# EAGLE design interface_spellman_detector (EAGLE 7.2.0)
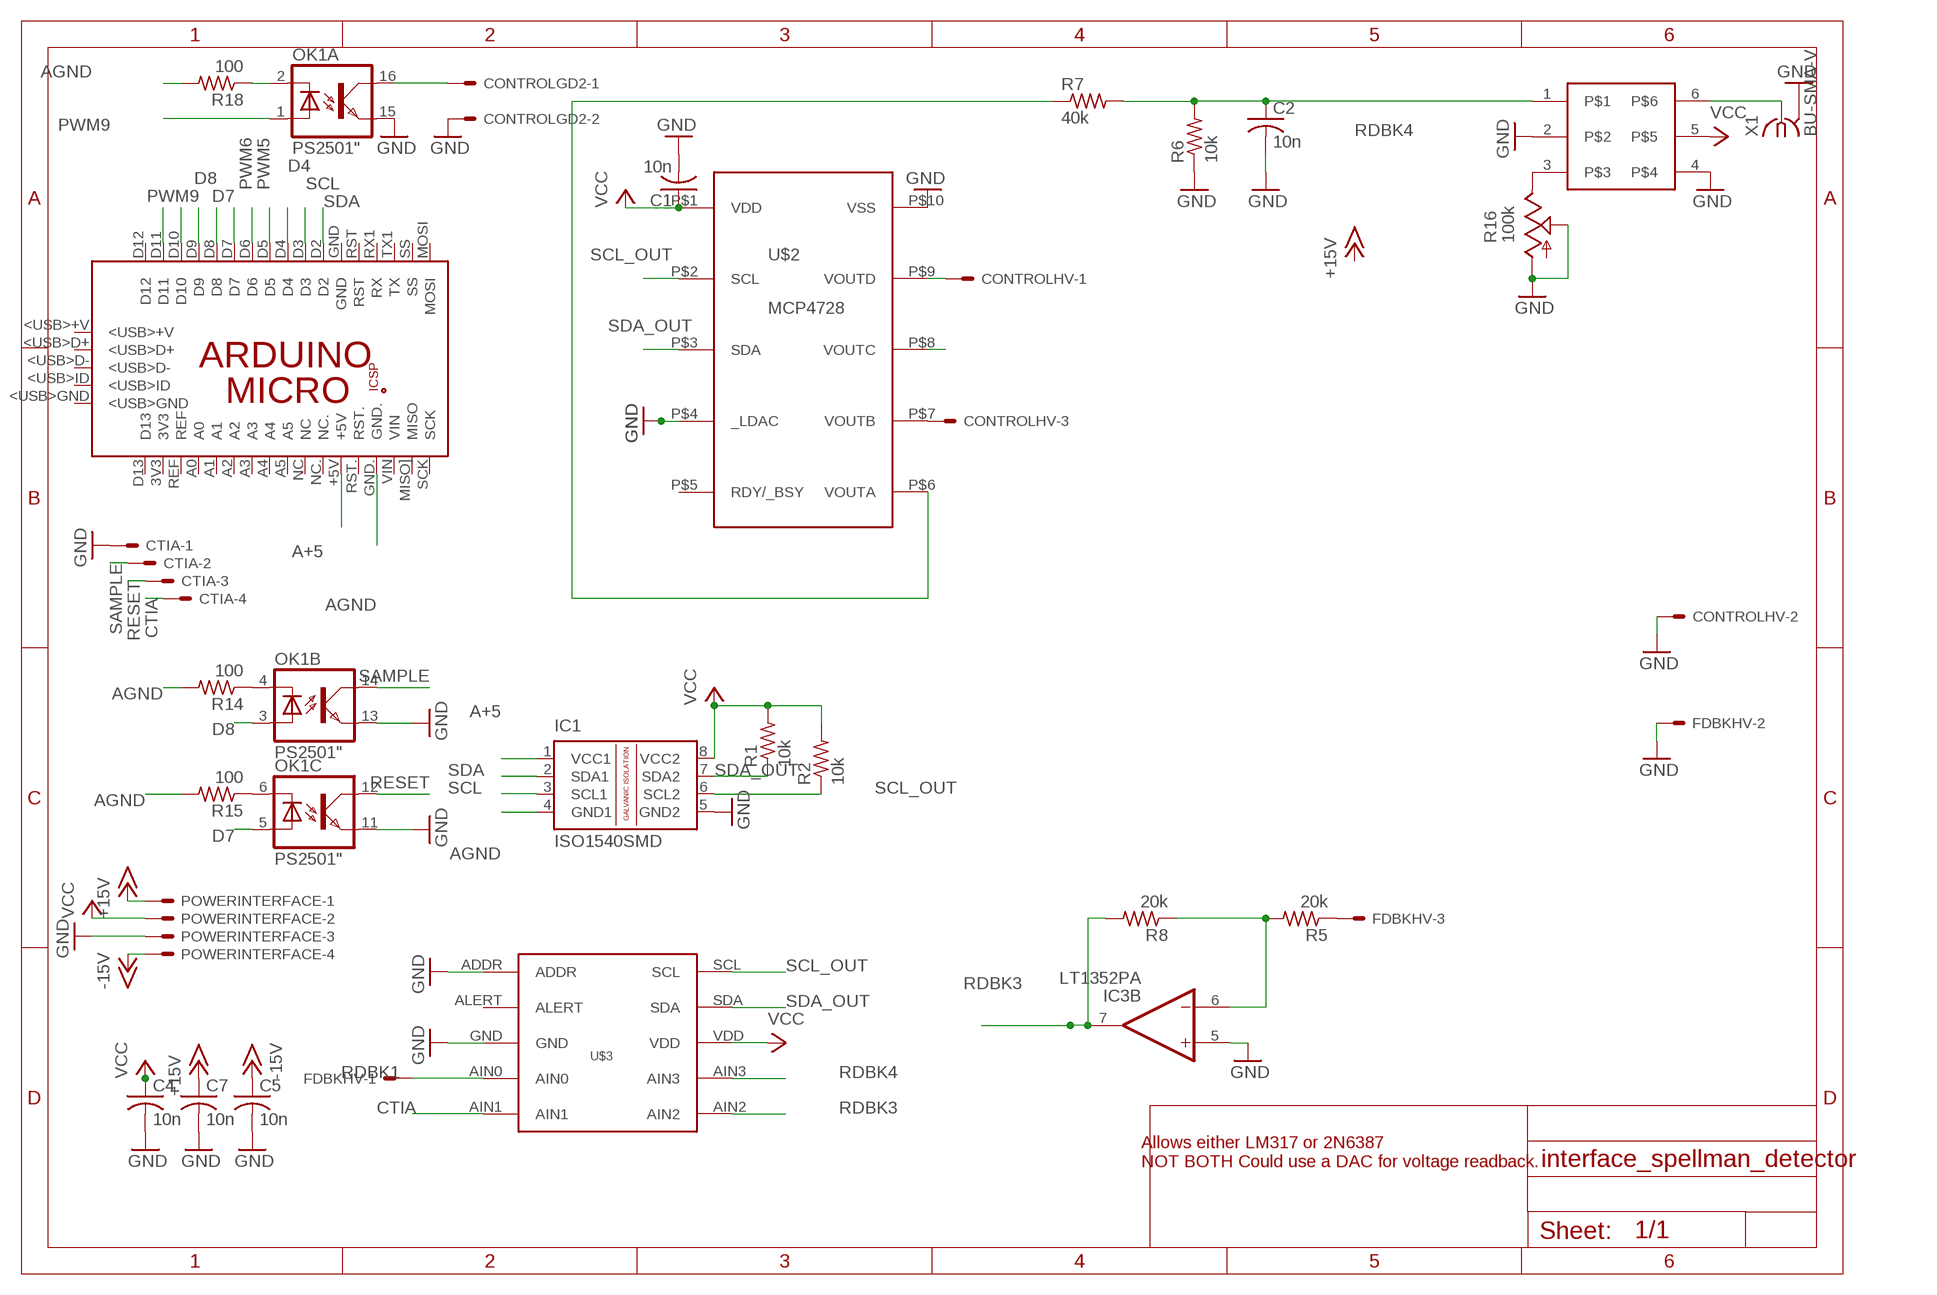
[diagram p0: schematic, sheet 1]

## Parts
C1  10n  C-USC0805K  [C0805K]
C2  10n  C-USC0805K  [C0805K]
C4  10n  C-USC0805K  [C0805K]
C5  10n  C-USC0805K  [C0805K]
C7  10n  C-USC0805K  [C0805K]
CONTROLGD2  KK-156-2  [KK-156-2]
CONTROLHV  KK-156-3  [KK-156-3]
CTIA  KK-156-4  [KK-156-4]
FDBKHV  KK-156-3  [KK-156-3]
IC1  ISO1540SMD  [SOIC8]
IC3  LT1352PA  [DIL08]
OK1  PS2501"  [DIL16]
PCB1  ARDUINO_MICRO  [ARDUINO_MICRO]
POWERINTERFACE  KK-156-4  [KK-156-4]
R1  10k  R-US_R0805  [R0805]
R2  10k  R-US_R0805  [R0805]
R5  20k  R-US_R0805  [R0805]
R6  10k  R-US_R0805  [R0805]
R7  40k  R-US_R0805  [R0805]
R8  20k  R-US_R0805  [R0805]
R14  100  R-US_R0805  [R0805]
R15  100  R-US_R0805  [R0805]
R16  100k  TRIM_US-B64Y  [B64Y]
R18  100  R-US_R0805  [R0805]
U$1  LTC6992SMD  [SOT23-6]
U$2  MCP4728  [MSOP-10]
U$3  ADS1015  [VSOP-10]
X1  BU-SMA-V  [BU-SMA-V]

## Nets
+15V: C7.1 POWERINTERFACE.1
-15V: C5.1 POWERINTERFACE.4
A+5: IC1.1(VCC1) PCB1.+5V
AGND: IC1.4(GND1) PCB1.GND. R14.2 R15.2 R18.2
CTIA: CTIA.4 U$3.AIN1
D4: PCB1.D4
D7: OK1.5(C:A) PCB1.D7
D8: OK1.3(B:A) PCB1.D8
D10: PCB1.D10
D11: PCB1.D11
ENSW2: CONTROLGD2.1 OK1.16(A:COL)
GND: C1.2 C2.2 C4.2 C5.2 C7.2 CONTROLGD2.2 CONTROLHV.2 CTIA.1 FDBKHV.2 IC1.5(GND2) IC3.5(B:+IN) OK1.11(C:EMI) OK1.13(B:EMI) OK1.15(A:EMI) POWERINTERFACE.3 R6.1 R16.A R16.S U$1.2 U$1.4 U$2.P$4(_LDAC) U$2.P$10(VSS) U$3.ADDR U$3.GND X1.2 X1.3 X1.4 X1.5
N$1: R7.1 U$2.P$6(VOUTA)
N$2: OK1.4(B:C) R14.1
N$3: CONTROLHV.3 U$2.P$7(VOUTB)
N$6: OK1.6(C:C) R15.1
N$7: OK1.2(A:C) R18.1
N$8: FDBKHV.3 R5.1
N$12: R16.E U$1.3
N$13: U$1.6 X1.1
N$23: IC3.6(B:-IN) R5.2 R8.1
N$24: CONTROLHV.1 U$2.P$9(VOUTD)
N$26: U$2.P$8(VOUTC)
PWM5: PCB1.D5
PWM6: PCB1.D6
PWM9: OK1.1(A:A) PCB1.D9
RDBK1: FDBKHV.1 U$3.AIN0
RDBK3: IC3.7(B:OUT) R8.2 U$3.AIN2
RDBK4: C2.1 R6.2 R7.2 U$1.1 U$3.AIN3
RESET: CTIA.3 OK1.12(C:COL)
SAMPLE: CTIA.2 OK1.14(B:COL)
SCL: IC1.3(SCL1) PCB1.D3
SCL_OUT: IC1.6(SCL2) R2.1 U$2.P$2(SCL) U$3.SCL
SDA: IC1.2(SDA1) PCB1.D2
SDA_OUT: IC1.7(SDA2) R1.1 U$2.P$3(SDA) U$3.SDA
VCC: C1.1 C4.1 IC1.8(VCC2) POWERINTERFACE.2 R1.2 R2.2 U$1.5 U$2.P$1(VDD) U$3.VDD
Unconnected: IC3.1(A:OUT) IC3.2(A:-IN) IC3.3(A:+IN) OK1.7(D:A) OK1.8(D:C) OK1.9(D:EMI) OK1.10(D:COL) PCB1.3V3 PCB1.5V PCB1.<USB>+V PCB1.<USB>D+ PCB1.<USB>D- PCB1.<USB>GND PCB1.<USB>ID PCB1.A0 PCB1.A1 PCB1.A2 PCB1.A3 PCB1.A4 PCB1.A5 PCB1.D12 PCB1.D13 PCB1.GND PCB1.GND_ PCB1.MISO. PCB1.MISO](MISO) PCB1.MOSI PCB1.MOSI. PCB1.NC PCB1.NC. PCB1.REF PCB1.RESET.. PCB1.RST PCB1.RST. PCB1.RX1(RX) PCB1.SCK PCB1.SCK. PCB1.SS PCB1.TX1(TX) PCB1.VIN U$2.P$5(RDY/_BSY) U$3.ALERT

## Notes on the sheet
- Allows either LM317 or 2N6387
  NOT BOTH Could use a DAC for voltage readback.

## Power pins joined to a net without a drawn wire
V+: IC3.8(A:V+)
V-: IC3.4(A:V-)

## Library data of the parts
C1 = rcl:C-US: CAPACITOR, American symbol
C2 C4 C5 C7 = resistor:C-US: CAPACITOR, American symbol
CONTROLGD2 = con-molex:KK-156-2: KK 156 HEADER Source: http://www.molex.com/pdm_docs/sd/026604100_sd.pdf; OC_FARNELL: unknown; OC_NEWARK: unknown
CONTROLHV FDBKHV = con-molex:KK-156-3: KK 156 HEADER Source: http://www.molex.com/pdm_docs/sd/026604100_sd.pdf; OC_FARNELL: unknown; OC_NEWARK: unknown
CTIA POWERINTERFACE = con-molex:KK-156-4: KK 156 HEADER Source: http://www.molex.com/pdm_docs/sd/026604100_sd.pdf; OC_FARNELL: unknown; OC_NEWARK: unknown
IC1 = texas:ISO1540: ISOLATED CAN TRANSCEIVER Source: http://focus.ti.com/lit/ds/symlink/iso1050.pdf
IC3 = linear-technology:LT1352: Dual Operational Amplifiers Source: http://datasheets.maxim-ic.com/en/ds/ICL7612-ICL764X.pdf; OC_FARNELL: unknown; OC_NEWARK: unknown
OK1 = optocoupler:PS2501: SHARP OPTO COUPLER
PCB1 = E14_Arduino_published:ARDUINO_MICRO: Device for representing an Arduino Micro board with a footprint in an EAGLE design. Created by Dave Young for Element14. More EAGLE documentation at: http://www.element14.com/community/community/knode/cadsoft_eagle
R1 R2 R5-R8 = resistor:R-US_: RESISTOR, American symbol
R14 R15 R18 = rcl:R-US_: RESISTOR, American symbol
R16 = pot:TRIM_US-: POTENTIOMETER
U$1 = linear-technology:LTC6992
U$2 = microchip:MCP4728
U$3 = texas:ADS1015
X1 = con-coax:BU-SMA-V: FEMALE SMA CONNECTOR Radiall distributor RS 112-3794; OC_FARNELL: unknown; OC_NEWARK: unknown

## Board
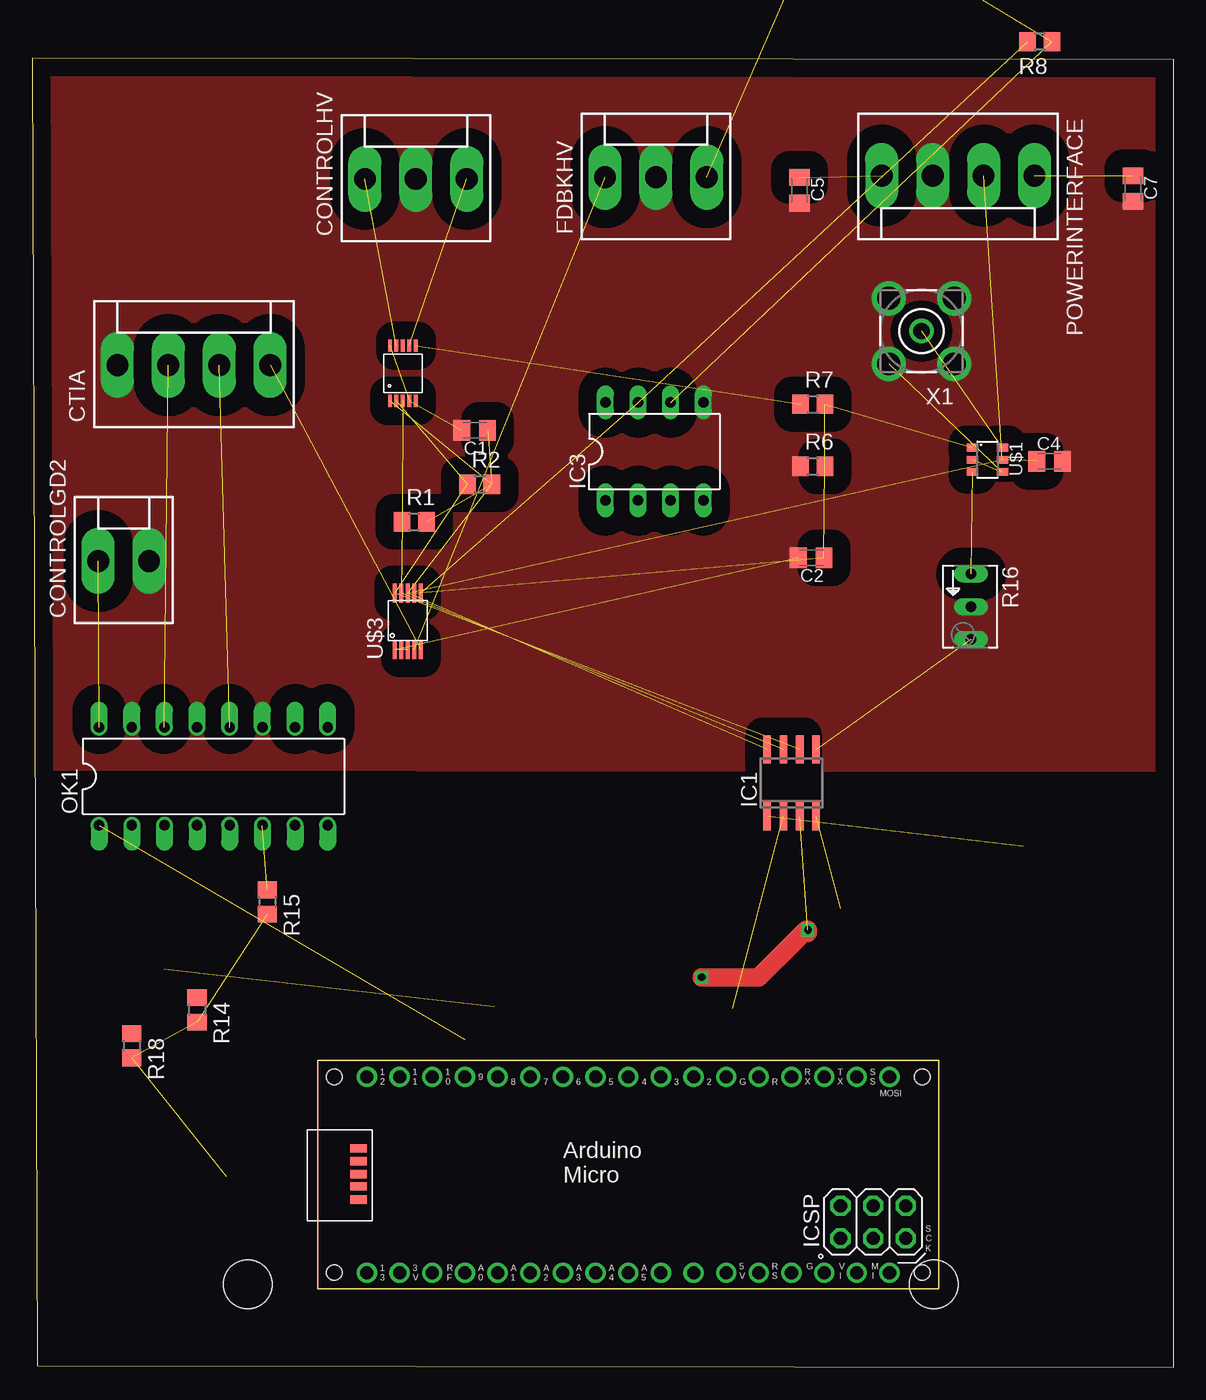
[diagram p1: board, top side]
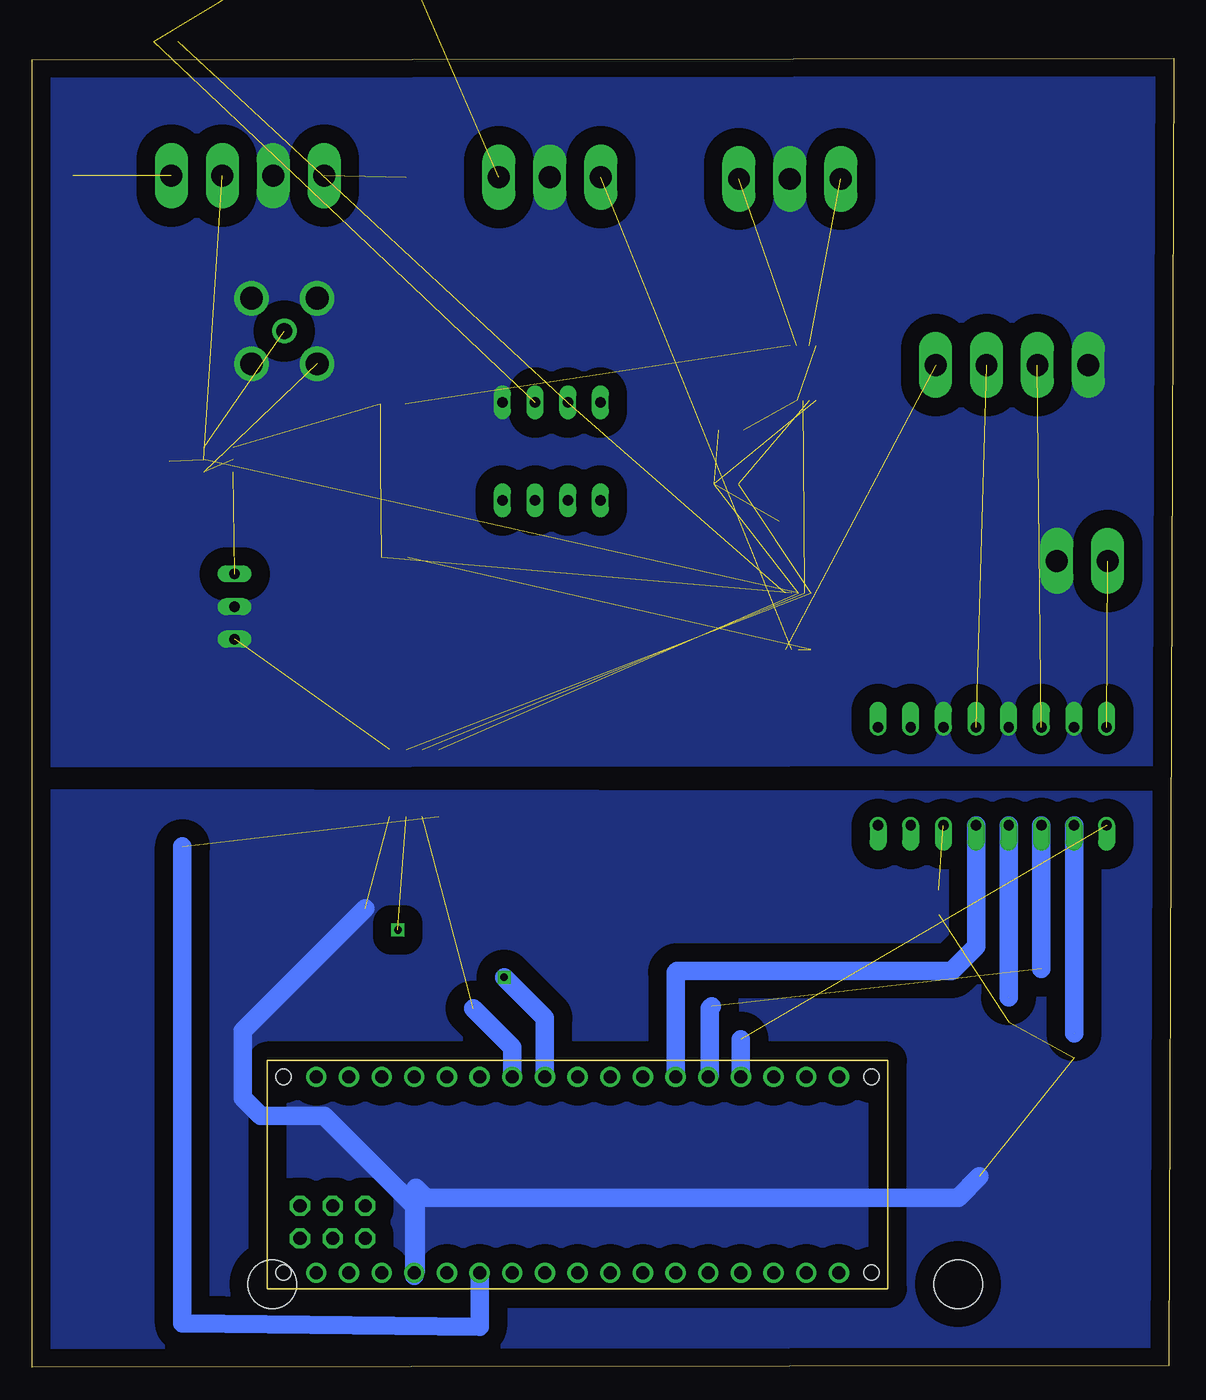
[diagram p2: board, bottom side, seen from below]

Size 88.77 x 101.85 mm. Coordinates in mm from the lower left corner, seen from the top.
Outline: 0.38,0.13 88.77,0 88.77,101.73 0,101.85 0.38,0.13
Copper layers (1*16): Top 0.035mm / dielectric 1.5mm / Bottom 0.035mm
Design rules "default *": minimum track width 6mil, minimum drill 15mil, track to track 6mil, track to pad 6mil, pad to pad 6mil, via to via 6mil, smd to smd 6mil, copper to edge 40mil, drill to drill 8mil, minimum pad ring 10mil, minimum via ring 8mil, stop-mask expansion 4mil, vias tented up to drill 0mil, thermal gap 10mil
Holes 3.8 mm at 70.1,6.48 16.76,6.48 9.53,114.3 86.23,112.9

### Footprints (pad centres in the part's own frame; a part is rotated, then mirrored left to right if it is on the bottom)
C0805K = smd 1.3 x 1.6: 1 -1,0; 2 1,0
KK-156-2 = drill 1.7 pad 2.184 long: 1 -1.98,0; 2 1.98,0
KK-156-3 = drill 1.7 pad 2.184 long: 1 -3.96,0; 2 0,0; 3 3.96,0
KK-156-4 = drill 1.7 pad 2.184 long: 1 -5.94,0; 2 -1.98,0; 3 1.98,0; 4 5.94,0
SOIC8 = smd 0.6 x 2.2: 1 -1.905,-2.6; 2 -0.635,-2.6; 3 0.635,-2.6; 4 1.905,-2.6; 5 1.905,2.6; 6 0.635,2.6; 7 -0.635,2.6; 8 -1.905,2.6
DIL08 = drill 0.813 long: 1 -3.81,-3.81; 2 -1.27,-3.81; 3 1.27,-3.81; 4 3.81,-3.81; 5 3.81,3.81; 6 1.27,3.81; 7 -1.27,3.81; 8 -3.81,3.81
DIL16 = drill 0.813 offset: 1 -8.89,-3.81; 2 -6.35,-3.81; 3 -3.81,-3.81; 4 -1.27,-3.81; 5 1.27,-3.81; 6 3.81,-3.81; 7 6.35,-3.81; 8 8.89,-3.81; 9 8.89,3.81; 10 6.35,3.81; 11 3.81,3.81; 12 1.27,3.81; 13 -1.27,3.81; 14 -3.81,3.81; 15 -6.35,3.81; 16 -8.89,3.81
ARDUINO_MICRO = drill 1.016 pad 1.575: 3V3 6.35,1.27; +5V 31.75,1.27; A0 11.43,1.27; A1 13.97,1.27; A2 16.51,1.27; A3 19.05,1.27; A4 21.59,1.27; A5 24.13,1.27; D2 29.21,16.51; D3 26.67,16.51; D4 24.13,16.51; D5 21.59,16.51; D6 19.05,16.51; D7 16.51,16.51; D8 13.97,16.51; D9 11.43,16.51; D10 8.89,16.51; D11 6.35,16.51; D12 3.81,16.51; D13 3.81,1.27; GND 31.75,16.51; GND. 36.83,1.27; MISO] 41.91,1.27; MOSI 44.45,16.51; NC 26.67,1.27; NC. 29.21,1.27; REF 8.89,1.27; RST 34.29,16.51; RST. 34.29,1.27; RX1 36.83,16.51; SCK 44.45,1.27; SS 41.91,16.51; TX1 39.37,16.51; VIN 39.37,1.27 | drill 1.016 pad 1.575 octagon: 5V 40.64,6.477; GND_ 45.72,6.477; MISO. 40.64,3.937; MOSI. 43.18,6.477; RESET.. 45.72,3.937; SCK. 43.18,3.937 | smd 1.27 x 0.635: <USB>+V 3.15,10.947; <USB>D+ 3.15,9.957; <USB>D- 3.15,8.941; <USB>GND 3.15,6.96; <USB>ID 3.15,7.976 | hole 1.2: 1.27,1.27; 1.27,16.51; 46.99,16.51; 46.99,1.27
R0805 = smd 1.3 x 1.5: 1 -0.95,0; 2 0.95,0
B64Y = drill 0.813 long: A 2.54,0; E -2.54,0; S 0,0
SOT23-6 = smd 0.6 x 0.9: 1 -0.95,-1.15; 2 0,-1.15; 3 0.95,-1.15; 4 0.95,1.15; 5 0,1.15; 6 -0.95,1.15
MSOP-10 = smd 0.95 x 0.3: P$1 -2.15,1; P$2 -2.15,0.5; P$3 -2.15,0; P$4 -2.15,-0.5; P$5 -2.15,-1; P$6 2.15,-1; P$7 2.15,-0.5; P$8 2.15,0; P$9 2.15,0.5; P$10 2.15,1
VSOP-10 = smd 1.45 x 0.3: ADDR -2.2,1; AIN0 -2.2,-0.5; AIN1 -2.2,-1; AIN2 2.2,-1; AIN3 2.2,-0.5; ALERT -2.2,0.5; GND -2.2,0; SCL 2.2,1; SDA 2.2,0.5; VDD 2.2,0
BU-SMA-V = drill 1.27: 1 0,0 | drill 1.778: 2 -2.55,2.55; 3 2.55,2.55; 4 2.55,-2.55; 5 -2.55,-2.55

### Placement (x,y rotation side)
C1  34.42,72.9 180 top
C2  60.58,62.99 180 top
C4  79.12,70.48 0 top
C5  59.69,91.57 270 top
C7  85.6,91.69 270 top
CONTROLGD2  7.11,62.74 0 top
CONTROLHV  29.84,92.46 0 top
CTIA  12.57,77.98 0 top
FDBKHV  48.51,92.58 0 top
IC1  59.05,45.47 0 top
IC3  48.39,71.25 0 top
OK1  14.1,45.97 0 top
PCB1  22.23,6.1 0 top
POWERINTERFACE  72.01,92.71 180 top
R1  29.72,65.79 0 top
R2  34.8,68.71 0 top
R5  62.23,112.9 0 top  (outside the outline)
R6  60.71,70.1 0 top
R7  60.71,74.93 0 top
R8  78.36,103.12 180 top
R14  12.83,27.81 270 top
R15  18.29,36.2 270 top
R16  73.03,59.18 270 top
R18  7.75,25.02 270 top
U$1  74.3,70.61 270 top
U$2  28.83,77.34 90 top
U$3  29.21,58.04 90 top
X1  69.16,80.62 180 top

### Tracks (layer width: path | path; a pad name or v marks a point on that pad's centre or on a via)
+15V  (1 unrouted)
-15V  (1 unrouted)
A+5  (1 unrouted)
  Bottom 1.422: PCB1.+5V 53.98,3.17 77.09,3.43 77.09,40.51
AGND  (4 unrouted)
  Bottom 1.422: 62.87,35.69 72.39,26.16 72.39,20.95 70.99,19.56 66.04,19.56 59.05,12.57 PCB1.GND. | PCB1.GND. 59.05,7.11 | 15.11,14.86 16.76,13.21 58.17,13.21 58.93,13.97 58.93,7.49 PCB1.GND.
  pour Bottom (isolate 1.422): 0.25,0.25 89.03,0.25 89.03,44.83 0.38,44.7
CTIA  (1 unrouted)
D7
  Bottom 1.422: OK1.5 15.37,32.77 17.27,30.86 38.61,30.86 38.73,30.73 PCB1.D7
D8  (1 unrouted)
  Bottom 1.422: OK1.3 10.29,30.99 | 35.94,28.07 36.07,27.94 36.07,22.73 PCB1.D8
ENSW2  (1 unrouted)
GND  (7 unrouted)
  pour Bottom (isolate 1.422, no thermals): 0,101.6 88.65,101.6 88.77,46.86 0.38,46.99
  pour Top (isolate 1.422, no thermals): 0,101.73 88.52,101.6 88.9,46.48 0.38,46.61
N$1  (1 unrouted)
N$2  (1 unrouted)
  Bottom 1.422: OK1.4 R14.1
N$3  (1 unrouted)
N$6  (1 unrouted)
N$7  (1 unrouted)
  Bottom 1.422: R18.1 OK1.2
N$8  (1 unrouted)
N$12  (1 unrouted)
N$13  (1 unrouted)
N$23  (2 unrouted)
N$24  (1 unrouted)
PWM9  (1 unrouted)
  Bottom 1.422: 33.66,25.53 PCB1.D9
RDBK1  (1 unrouted)
RDBK3  (2 unrouted)
RDBK4  (4 unrouted)
RESET  (1 unrouted)
SAMPLE  (1 unrouted)
SCL  (via drill 0.6)  (1 unrouted)
  Top 1.422: v52.07,30.35 56.52,30.35 60.2,34.04 60.33,33.78 v60.33,34.04
  Bottom 1.422: PCB1.D3 48.9,27.18 v52.07,30.35
SCL_OUT  (3 unrouted)
SDA  (1 unrouted)
  Bottom 1.422: PCB1.D2 51.44,24.89 54.48,27.94
SDA_OUT  (3 unrouted)
VCC  (8 unrouted)